# Altium schematic sheet 开关原理图.SchDoc
size A4
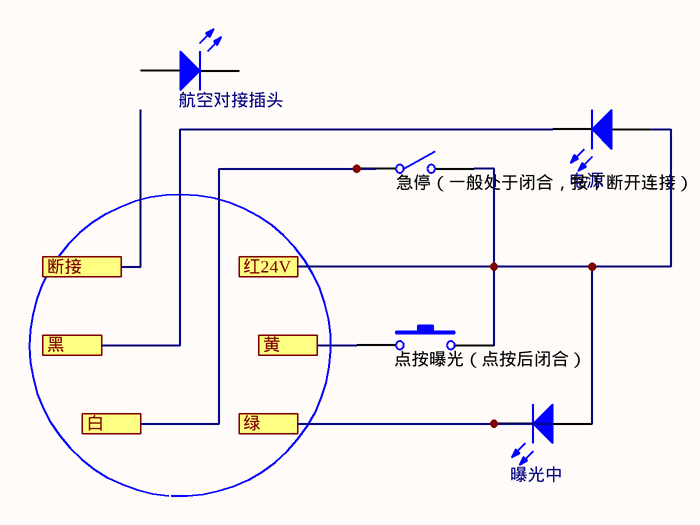
[diagram p0: 开关原理图.SchDoc]

## Parts
(Parts that share a designator on the sheet are numbered #1, #2 ... from top to bottom, then left to right.)
S?#1  急停（一般处于闭合，按下断开连接）  [SPST-2]
S?#2  点按曝光（点按后闭合）  [SPST-2]
红色指示灯  航空对接插头  [LED-1]
红色指示灯?#1  电源  [LED-1]
红色指示灯?#2  曝光中  [LED-1]

## Ports
断接, 白, 红24V, 绿, 黄, 黑

## Nets
白: S?#1.1(COMMON) ; port 白
红24V: S?#1.2(NO) S?#2.2 红色指示灯?#1.1(A) 红色指示灯?#2.1(A) ; port 红24V
绿: 红色指示灯?#2.2(K) ; port 绿
黄: S?#2.1 ; port 黄
黑: 红色指示灯?#1.2(K) ; port 黑

Not connected (* = marked no-connect by the designer): 红色指示灯 1(A) 2(K)

## Library data of the parts
S?#1 = SW-SPST: Single-Pole, Single-Throw Switch; Published: 24-Mar-1999; LatestRevisionDate: 17-Jul-2002; LatestRevisionNote: Re-released for DXP Platform.; PackageReference: SPST-2; Publisher: Altium Limited; PackageDescription: Switch; 2 Leads
S?#2 = SW-PB: Switch; Published: 24-Mar-1999; LatestRevisionDate: 17-Jul-2002; LatestRevisionNote: Re-released for DXP Platform.; PackageReference: SPST-2; Publisher: Altium Limited; PackageDescription: Switch; 2 Leads
红色指示灯 红色指示灯?#1 红色指示灯?#2 = LED1: Typical RED GaAs LED; Published: 8-Jun-2000; LatestRevisionDate: 08-Jul-2005; LatestRevisionNote: Mech Layer 1 removed.; PackageReference: LED-1; Publisher: Altium Limited; PackageDescription: LED; 2 Leads